# Altium project Battery_Redundancy.PrjPcb
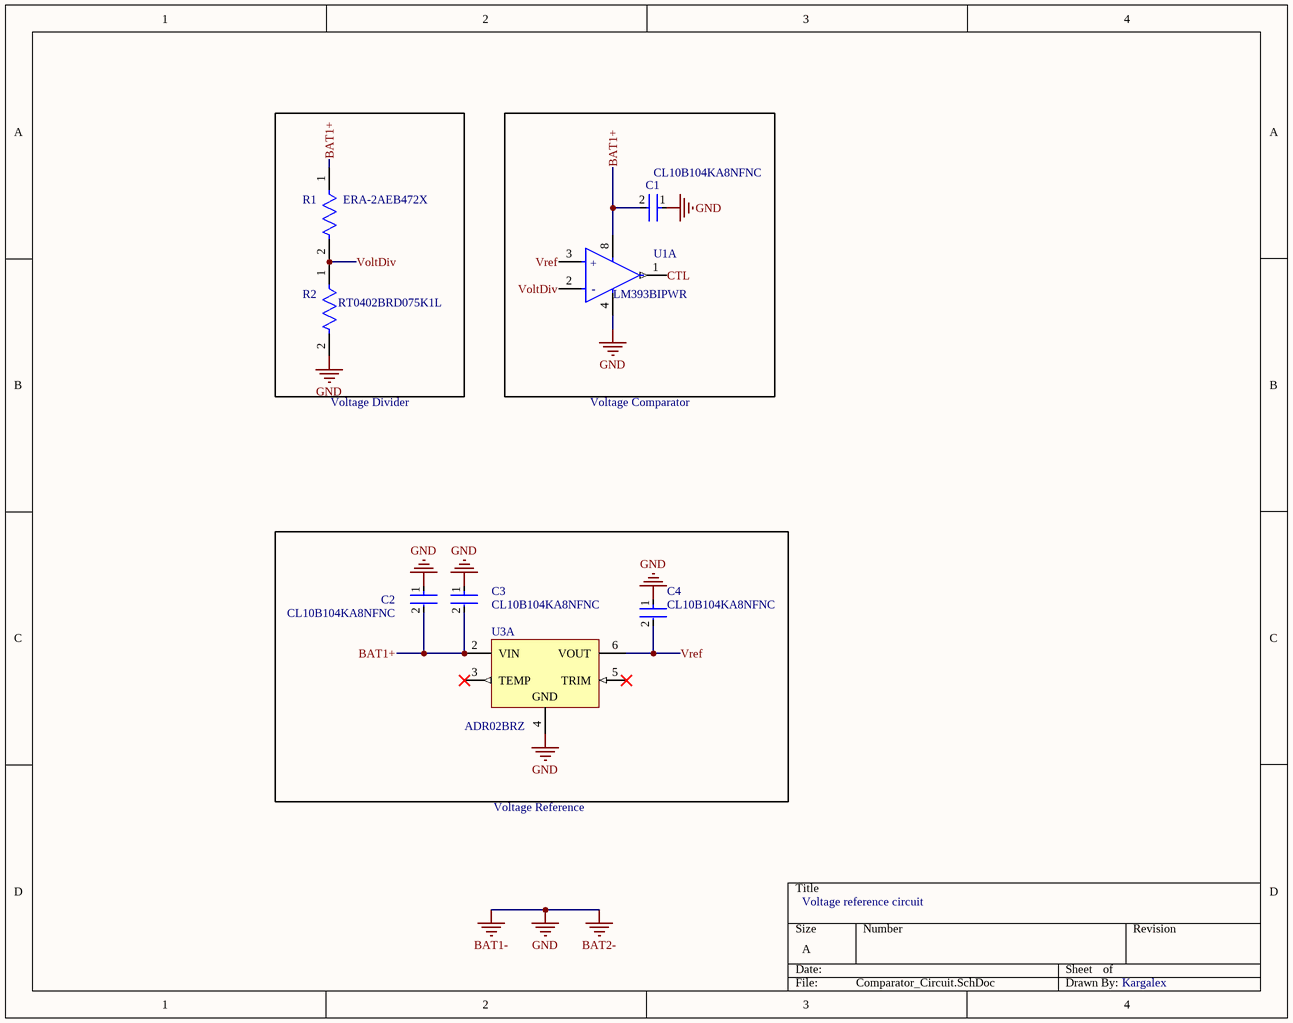
[diagram p0: Comparator_Circuit.SchDoc]
2 sheets, 16 parts. Net scope: global (net labels, ports and power ports of the same name join across sheets).
Board file: PCB1.PcbDoc
Sheets:
  Comparator_Circuit.SchDoc
  Main_Circuit.SchDoc

## Sheet Comparator_Circuit.SchDoc
size A; SheetNumber: 1; SheetTotal: 2

### Parts
C1  CL10B104KA8NFNC  [FP-CL10-IPC_C]
C2  CL10B104KA8NFNC  [FP-CL10-IPC_C]
C3  CL10B104KA8NFNC  [FP-CL10-IPC_C]
C4  CL10B104KA8NFNC  [FP-CL10-IPC_C]
R1  ERA-2AEB472X  [FP-ERA2A-IPC_A]
R2  RT0402BRD075K1L  [FP-RT0402-MFG]
U1  LM393BIPWR  [FP-PW0008A-MFG]  (part A of 2)
U3  ADR02BRZ  [ADI-R-8_L]  (part A of 2)

### Nets
BAT1-: C1.1 C2.1 C3.1 C4.1 R2.2 U1.4(GND) U3.4(GND)  [also labelled BAT2-, GND]
BAT1+: C1.2 C2.2 C3.2 R1.1 U1.8(VCC) U3.2(VIN)
CTL: U1.1(1OUT)
VoltDiv: R1.2 R2.1 U1.2(1IN-)
Vref: C4.2 U1.3(1IN+) U3.6(VOUT)

Not connected (* = marked no-connect by the designer): U3 3(TEMP)* 5(TRIM)*

### Notes on the sheet
- Voltage Divider
- Voltage Comparator
- Output is input of LTC4412 CTL pin // when output is high --> switch battery
- (near U3) @TEMP can be used in future designs to measure temperature
- Voltage Reference
- Voltage reference circuit
- Kargalex
- (in symbol CMP-04896-000024-1, part A) +; -

### Library data of the parts
C1-C4 = CMP-13271-001423-1: Cap Ceramic 100nF 25V X7R ±10% Pad SMD 0603 +125°C T/R; Depth: 0.8mm; Tolerance: 10%; Case Code (Imperial): 0603; Max Operating Temperature: 125°C; Min Operating Temperature: -55°C; Dielectric: X7R; Width: 0.031inch; Thickness: 0.035inch; Height: 0.8mm; Length: 1.6mm; Mount: Surface Mount; Capacitance: 100nF; Voltage Rating: 25V; Case Code (Metric): 1608; Case/Package: 0603; Radiation Hardening: No; Packaging: Tape and Reel
R1 = CMP-2002-05888-2: RES SMD 4.7K OHM 0.1% 1/16W 0402; Temperature Coefficient: 25ppm/°C; Voltage Rating: 25V; Resistance: 4.7kR; Power Rating: 63mW; Radiation Hardening: No; Series: ERA-2A; Min Operating Temperature: -55°C; Packaging: Tape and Reel; Package Quantity: 1; Mount: Surface Mount; Case Code (Imperial): 0402; Case Code (Metric): 1005; Length: 1mm; Depth: 0.5mm; Tolerance: 0.1%; Construction: Rectangular; RoHS Compliant: Yes; Termination: SMD/SMT; Height: 0.35mm; Lead Free: Lead Free; Resistance Tolerance: 0.1%; Number of Pins: 2; Resistor Type: Thin Film; Military Standard: Not; REACH SVHC: No SVHC; Contact Plating: Tin; Max Operating Temperature: 155°C; Width: 0.02inch; Max Power Dissipation: 63mW; Size Code: 0402; Case/Package: 0402; Voltage Rating (DC): 25V; Number of Terminations: 2; Technology: METAL FILM
R2 = CMP-2002-02959-2: RES SMD 5.1K OHM 0.1% 1/16W 0402; Manufacturer: Yageo; Value: 5.1KΩ; Power Rating: 0.063W; Tolerance: 0.001; Voltage Rating: 50V; Temperature Coefficient: 25 ppm/°C; Temperature Range High: +155°C; Composition: Thin Film; Device Class L2: Resistors; Ipc Land Pattern Name: RESC10050X30; Octopart: https://octopart.com/rt0402brd075k1l-yageo-1430932; Height: 0.35mm; Package: RT0402; Footprint Url: http://www.yageo.com/exep/pages/download/literatures/PYu-R_Mount_10.pdf; Series: RT; RoHS: TRUE; Digikey Description: RES SMD 5.1K OHM 0.1% 1/16W 0402; ComponentLink2URL: http://www.yageo.com/documents/recent/PYu-RT_1-to-0.01_RoHS_L_9.pdf; Resistance: 5.1KΩ; Mouser Description: Thin Film Resistors 1/16W 5.1K ohm .1% 25ppm; Device Class L3: Chip SMD Resistors; Device Class L1: Passive Components; Manufacturer Part Number: RT0402BRD075K1L; Category: Res; Lead Free: Yes; ComponentLink2Description: Datasheet; Temperature Range Low: -55°C; Automotive: No; Temperature: -55°C to +155°C
U1 = CMP-04896-000024-1: Dual Comparators; Manufacturer: Texas Instruments; Output Current Per Channel: 25mA; Max Junction Temp: +150°C; Input Offset Voltage: 4mV; Response Time: 1us; Min Supply Voltage: 3V; Standoff Height: 0.05mm; Nominal Supply Current: 550uA; Input Bias Current: 0.0035uA; Number Of Channels: 2; Max Supply Voltage: 36V; Manufacturer Part Number: LM393BIPWR; Height: 1.2mm; Ambient Temperature Range Low: -40°C; Octopart: https://octopart.com/lm393bipwr-texas+instruments-107383910; Lead Free: Yes; Device Class L1: Integrated Circuits (ICs); ComponentLink2Description: Datasheet; Category: IC; Temperature Range Low: -40°C; RoHS: TRUE; Automotive: No; Device Class L3: Comparators; Ambient Temperature Range High: +85°C; Temperature Range High: +85°C; Device Class L2: Linear ICs; Temperature: -40°C to +85°C; ComponentLink2URL: http://www.ti.com/lit/ds/symlink/lm393b.pdf; Package: PW0008A
U3 = CMP-0784-00328-1: Ultracompact, Precision Voltage Reference, 5 V Output, 7 to 36 V Supply, Industrial, 8-pin SOIC (R-8), Tube; Manufacturer: Analog Devices; Vout: 5V; Automotive Qualified: Yes; Min V Supply (V): 7; Ref Out TC (ppm/C): 1; Max V Supply (V): 36; ComponentLink1Description: Manufacturer URL; ComponentLink3Description: Package Specification; ComponentLink1URL: http://www.analog.com/en/index.html; Packing: Tube; ComponentLink4URL: Product URL:http://www.analog.com/en/special-linear-functions/voltage-references/adr02/products/product.html; ComponentLink4Description: URL Link1; ComponentLink3URL: http://www.analog.com/static/imported-files/packages/PKG_PDF/SOIC_Narrow%20(R)/R_8.pdf; Mounting Technology: Surface Mount; PackageDescription: 8-Pin Standard Small Outline Package, Body 4.9 x 3.9 mm, Pitch 1.27 mm; PartNumber: ADR02BRZ; ComponentLink2URL: http://www.analog.com/static/imported-files/data_sheets/ADR01_02_03_06.pdf; DatasheetVersion: Rev. R; Code_JEDEC: MS-012-AA; PackageReference: R-8; PackageVersion: 060506-A, 06/2006; ComponentLink2Description: Datasheet; Operating Temp Range: -40 to 125 degC

## Sheet Main_Circuit.SchDoc
size A; SheetNumber: 2; SheetTotal: 2
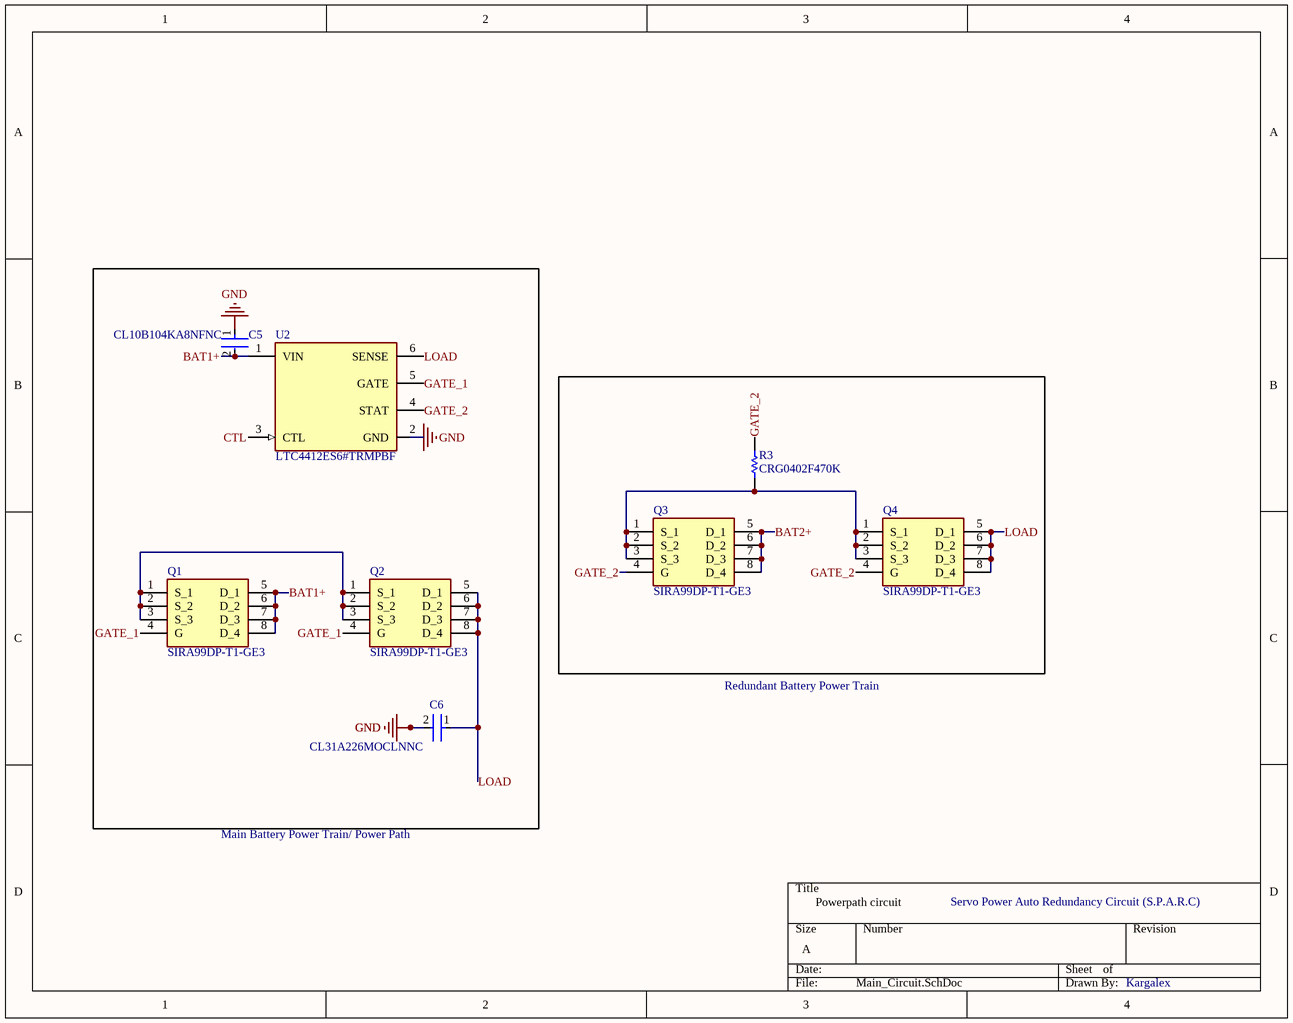
[diagram p1: Main_Circuit.SchDoc]

### Parts
C5  CL10B104KA8NFNC  [FP-CL10-IPC_C]
C6  CL31A226MOCLNNC  [FP-CL31-IPC_A]
Q1  SIRA99DP-T1-GE3  [SI7141DPT1GE3]
Q2  SIRA99DP-T1-GE3  [SI7141DPT1GE3]
Q3  SIRA99DP-T1-GE3  [SI7141DPT1GE3]
Q4  SIRA99DP-T1-GE3  [SI7141DPT1GE3]
R3  CRG0402F470K  [RESC1005X40X25LL10T10]
U2  LTC4412ES6#TRMPBF  [FP-S6-6-05-08-1636-IPC_C]

### Nets
GND: C5.1 C6.2 U2.2(GND)  [project net BAT1-]
BAT1+: C5.2 Q1.5(D_1) Q1.6(D_2) Q1.7(D_3) Q1.8(D_4) U2.1(VIN)
BAT2+: Q3.5(D_1) Q3.6(D_2) Q3.7(D_3) Q3.8(D_4)
CTL: U2.3(CTL)
GATE_1: Q1.4(G) Q2.4(G) U2.5(GATE)
GATE_2: Q3.4(G) Q4.4(G) R3.2 U2.4(STAT)
LOAD: C6.1 Q2.5(D_1) Q2.6(D_2) Q2.7(D_3) Q2.8(D_4) Q4.5(D_1) Q4.6(D_2) Q4.7(D_3) Q4.8(D_4) U2.6(SENSE)
NetQ1_1: Q1.1(S_1) Q1.2(S_2) Q1.3(S_3) Q2.1(S_1) Q2.2(S_2) Q2.3(S_3)
NetQ3_1: Q3.1(S_1) Q3.2(S_2) Q3.3(S_3) Q4.1(S_1) Q4.2(S_2) Q4.3(S_3) R3.1

### Notes on the sheet
- Redundant Battery Power Train
- Main Battery Power Train/ Power Path
- Powerpath circuit
- Servo Power Auto Redundancy Circuit (S.P.A.R.C)
- (near C6) @C6 value can be calculated with spice
  Simplified : C  = I*Δt(fall_time)/ΔV
- Kargalex

### Library data of the parts
C5 = CMP-13271-001423-1: as C1 on sheet Comparator_Circuit; Depth: 0.8mm; Tolerance: 10%; Case Code (Imperial): 0603; Max Operating Temperature: 125°C; Min Operating Temperature: -55°C; Dielectric: X7R; Width: 0.031inch; Thickness: 0.035inch; Height: 0.8mm; Length: 1.6mm; Mount: Surface Mount; Capacitance: 100nF; Voltage Rating: 25V; Case Code (Metric): 1608; Case/Package: 0603; Radiation Hardening: No; Packaging: Tape and Reel
C6 = CMP-13271-002013-1: Cap Ceramic 22uF 16V X5R ±20% SMD 1206 +85°C Embossed T/R; Height: 0.85mm; Min Operating Temperature: -55°C; Thickness: 0.037inch; Depth: 1.6mm; Length: 3.2mm; Tolerance: 20%; Case Code (Imperial): 1206; Capacitance: 22uF; Package Quantity: 1; Radiation Hardening: No; Case/Package: 1206; Dielectric: X5R; Packaging: Tape and Reel; Voltage: 16V; Case Code (Metric): 3216; Width: 0.063inch; Lead Free: Lead Free; Mount: Surface Mount; Voltage Rating: 16V; Max Operating Temperature: 85°C
Q1-Q4 = SIRA99DP-T1-GE3: MOSFET (P-Channel); Manufacturer_Name: Vishay; Datasheet Link: https://www.vishay.com/docs/71023/sira99dp.pdf; Manufacturer_Part_Number: SIRA99DP-T1-GE3; Mouser Part Number: 78-SIRA99DP-T1-GE3; Mouser Price/Stock: https://www.mouser.co.uk/ProductDetail/Vishay-Semiconductors/SIRA99DP-T1-GE3?qs=UkDUCjYnTB2B5E%2FMLQOT2A%3D%3D; Arrow Part Number: SIRA99DP-T1-GE3; Arrow Price/Stock: https://www.arrow.com/en/products/sira99dp-t1-ge3/vishay?region=nac
R3 = CMP-2002-05737-1: Manufacturer: TE Connectivity / AMP; Part Number: CRG0402F470K
U2 = CMP-0479-00425-2: IC OR CTRLR SRC SELECT TSOT23-6; Min Supply Voltage: 2.5V; Max Supply Voltage: 28V; Turn-On Delay Time: 110us; Number of Channels: 1; Lead Free: Lead Free; Length: 2.9mm; Radiation Hardening: No; RoHS Compliant: Yes; Package Quantity: 1; Min Operating Temperature: -40°C; Series: PowerPath™; Packaging: Tape and Reel; Width: 1.75mm; Height: 0.9mm; Number of Pins: 6; Max Operating Temperature: 85°C; Number of Outputs: 1; Case/Package: TSOT; REACH SVHC: No SVHC

## Nets that join several sheets
BAT1-: Comparator_Circuit (7 pins), Main_Circuit (C5.1 C6.2 U2.2)
BAT1+: Comparator_Circuit (6 pins), Main_Circuit (6 pins)
CTL: Comparator_Circuit (U1.1), Main_Circuit (U2.3)